# Altium project ESP-12.PrjPcb
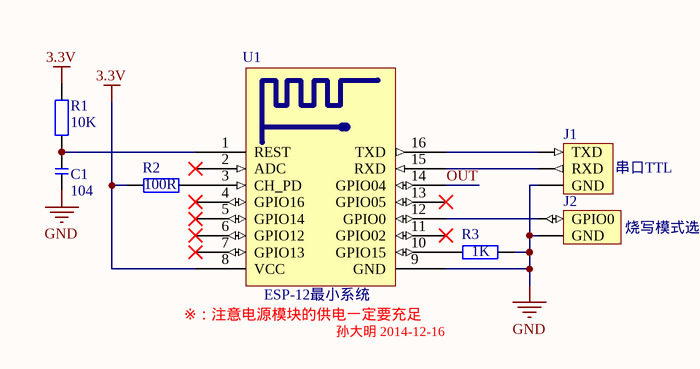
[diagram p0: ESP-12.SchDoc]
1 sheet, 7 parts. Net scope: global (net labels, ports and power ports of the same name join across sheets).
Board file: ESP-12.PcbDoc

## Sheet ESP-12.SchDoc
size A4

### Parts
C1  104  [0805]
J1  USART  (value not drawn)
J2  GPIO0  (value not drawn)
R1  10K  [0805]
R2  100R  [0805]
R3  1K  [0805]
U1  ESP-12  (value not drawn)

### Nets
3.3V: R1.2 R2.1 U1.8(VCC)
GND: C1.1 J1.3(GND) J2.2(GND) R3.2 U1.9(GND)
OUT: U1.14(GPIO04)
NetC1_2: C1.2 R1.1 U1.1(REST)
NetJ1_1: J1.1(TXD) U1.16(TXD)
NetJ1_2: J1.2(RXD) U1.15(RXD)
NetJ2_1: J2.1(GPIO0) U1.12(GPIO0)
NetR2_2: R2.2 U1.3(CH_PD)
NetR3_1: R3.1 U1.10(GPIO15)

Not connected (* = marked no-connect by the designer): U1 2(ADC)* 4(GPIO16)* 5(GPIO14)* 6(GPIO12)* 7(GPIO13)* 11(GPIO02)* 13(GPIO05)*

### Notes on the sheet
- 串口TTL
- 烧写模式选择
- (near U1) ※：注意电源模块的供电一定要充足
- (near U1) ESP-12最小系统
- 孙大明 2014-12-16

### Library data of the parts
C1 = 无极性电容 0805
R1-R3 = 电阻 0805